# EasyEDA Pro project ProPrj_PowMr-Hybrid-Inverter_2024-11-03.epro

# Schematic PowMr Hybrid Inverter

## Sheets
1 Main board
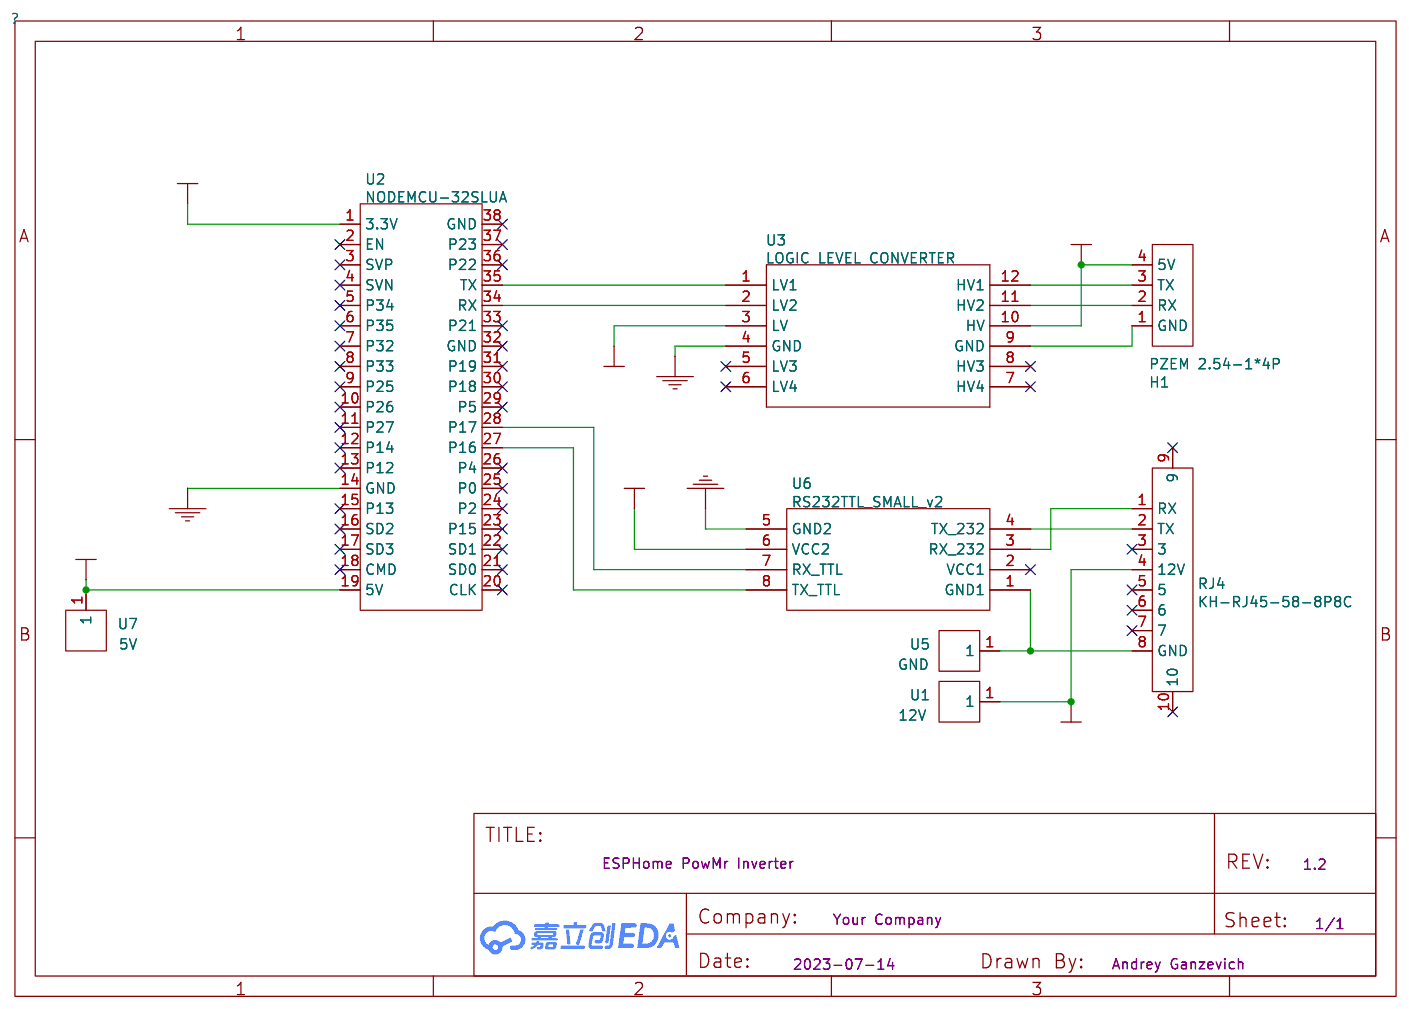
[diagram p0: Main board]
2 Modules: Board Name: PowMr Hybrid Inverter; Create Date: 2024-09-08; Page Name: Modules; Schematic Name: PowMr Hybrid Inverter; Update Date: 2024-09-10
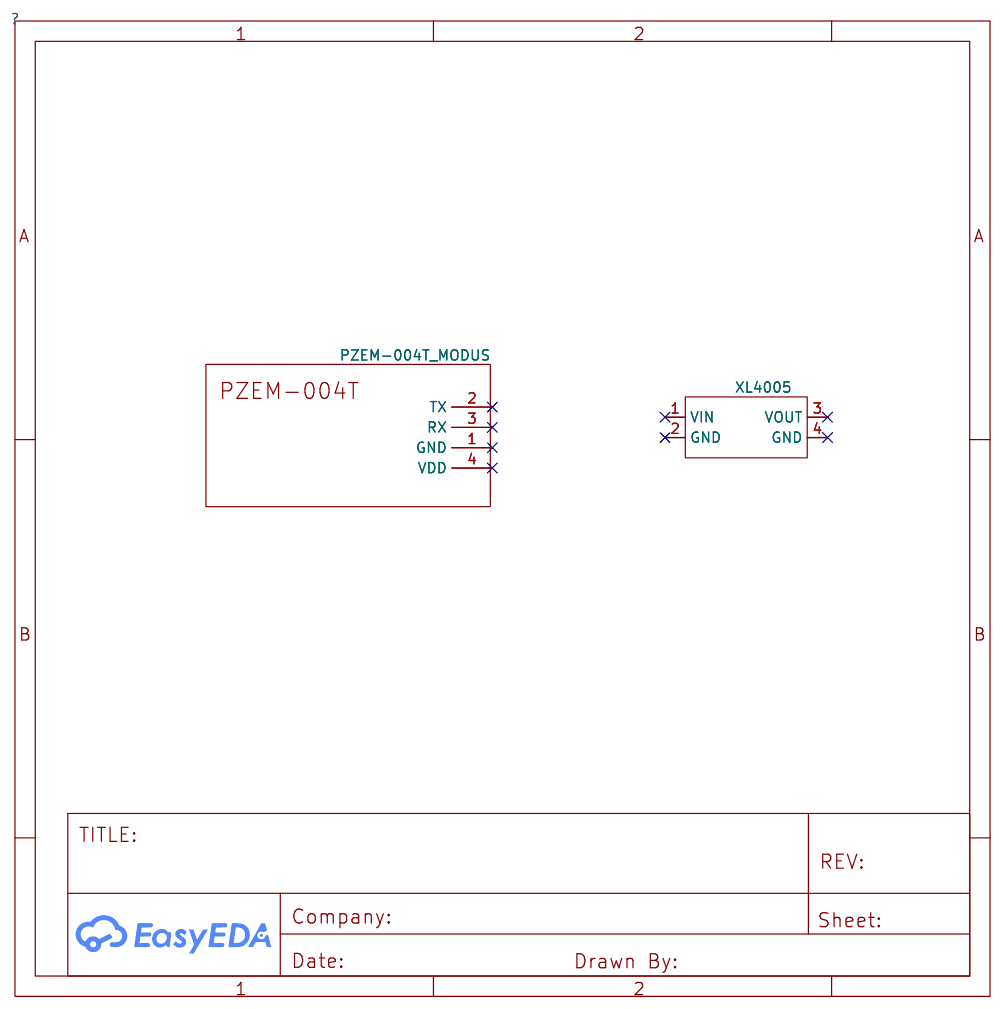
[diagram p1: Modules]

## Parts
sheet Main board
H1  PZEM 2.54-1*4P  [HDR-TH_4P-P2.54-H-M-W10.4]
RJ4  KH-RJ45-58-8P8C  [RJ45-TH_KH-RJ45-58-8P8C]
U1  12V  [2X2MMPAD]  (no BOM)
U2  NODEMCU-32SLUA  [COMM-TH_NODEMCU-32SLUA]
U3  LOGIC LEVEL CONVERTER  [LOGIC LEVEL CONVERTER]
U5  GND  [2X2MMPAD]  (no BOM)
U6  RS232TTL_SMALL_v2  [RS232TTL_SMALL]
U7  5V  [2X2MMPAD]  (no BOM)
sheet Modules
U4  PZEM-004T_MODUS  [PZEM-004T-V3]
U8  XL4005  [XL4005_SAAD]

## Library data of the parts
H1 = PZEM 2.54-1*4P: Supplier: LCSC; Supplier Part: C91552; Manufacturer: BOOMELE(博穆精密); Manufacturer Part: 2.54-1*4P反弯排针; JLCPCB Part Class: Extended Part
RJ4 = KH-RJ45-58-8P8C: Supplier: LCSC; Supplier Part: C2683360; Manufacturer: kinghelm(金航标); JLCPCB Part Class: Extended Part; link: https://lcsc.com/eda_search?q=C2683360&amp;%26type=1&amp;ref=editor
U1 = 12V
U2 = NODEMCU-32SLUA: Supplier: LCSC; Supplier Part: C111436; Manufacturer: Ai-Thinker(安信可); Manufacturer Part: NodeMCU-32SLua; JLCPCB Part Class: Extended Part; link: https://atta.szlcsc.com/upload/public/pdf/source/20200715/C111436_7E615125D57381075B07FD61BFD5F595.pdf
U3 = LOGIC LEVEL CONVERTER
U5 = GND
U6 = RS232TTL_SMALL_v2: Supplier: BANGGOOD
U7 = 5V
U4 = PZEM-004T_MODUS: Manufacturer Part: New SchematicLib
U8 = XL4005

## Nets
+5V: H1.4(5V) U2.19(5V) U3.10(HV) U7.1
+12V: RJ4.4(12V) U1.1
GND: U2.14(GND) U3.4(GND) U6.5(GND2)
VCC: U2.1(3.3V) U3.3(LV) U6.6(VCC2)
$1N4: U2.35(TX) U3.1(LV1)
$1N5: U2.34(RX) U3.2(LV2)
$1N8: H1.1(GND) U3.9(GND)
$1N9: U2.28(P17) U6.7(RX TTL)
$1N10: U2.27(P16) U6.8(TX TTL)
$1N11: RJ4.1(RX) U6.3(RX 232)
$1N12: RJ4.2(TX) U6.4(TX 232)
$1N13: RJ4.8(GND) U5.1 U6.1(GND1)
$1N18: H1.3(TX) U3.12(HV1)
$1N19: H1.2(RX) U3.11(HV2)

Not connected (* = marked no-connect by the designer): RJ4 3* 5* 6* 7* 9* 10*; U2 2(EN)* 3(SVP)* 4(SVN)* 5(P34)* 6(P35)* 7(P32)* 8(P33)* 9(P25)* 10(P26)* 11(P27)* 12(P14)* 13(P12)* 15(P13)* 16(SD2)* 17(SD3)* 18(CMD)* 20(CLK)* 21(SD0)* 22(SD1)* 23(P15)* 24(P2)* 25(P0)* 26(P4)* 29(P5)* 30(P18)* 31(P19)* 32(GND)* 33(P21)* 36(P22)* 37(P23)* 38(GND)*; U3 5(LV3)* 6(LV4)* 7(HV4)* 8(HV3)*; U4 1(GND)* 2(TX)* 3(RX)* 4(VDD)*; U6 2(VCC1)*; U8 1(VIN)* 2(GND)* 3(VOUT)* 4(GND)*

# Board 1-PCB_PCB_PowMr Inverter
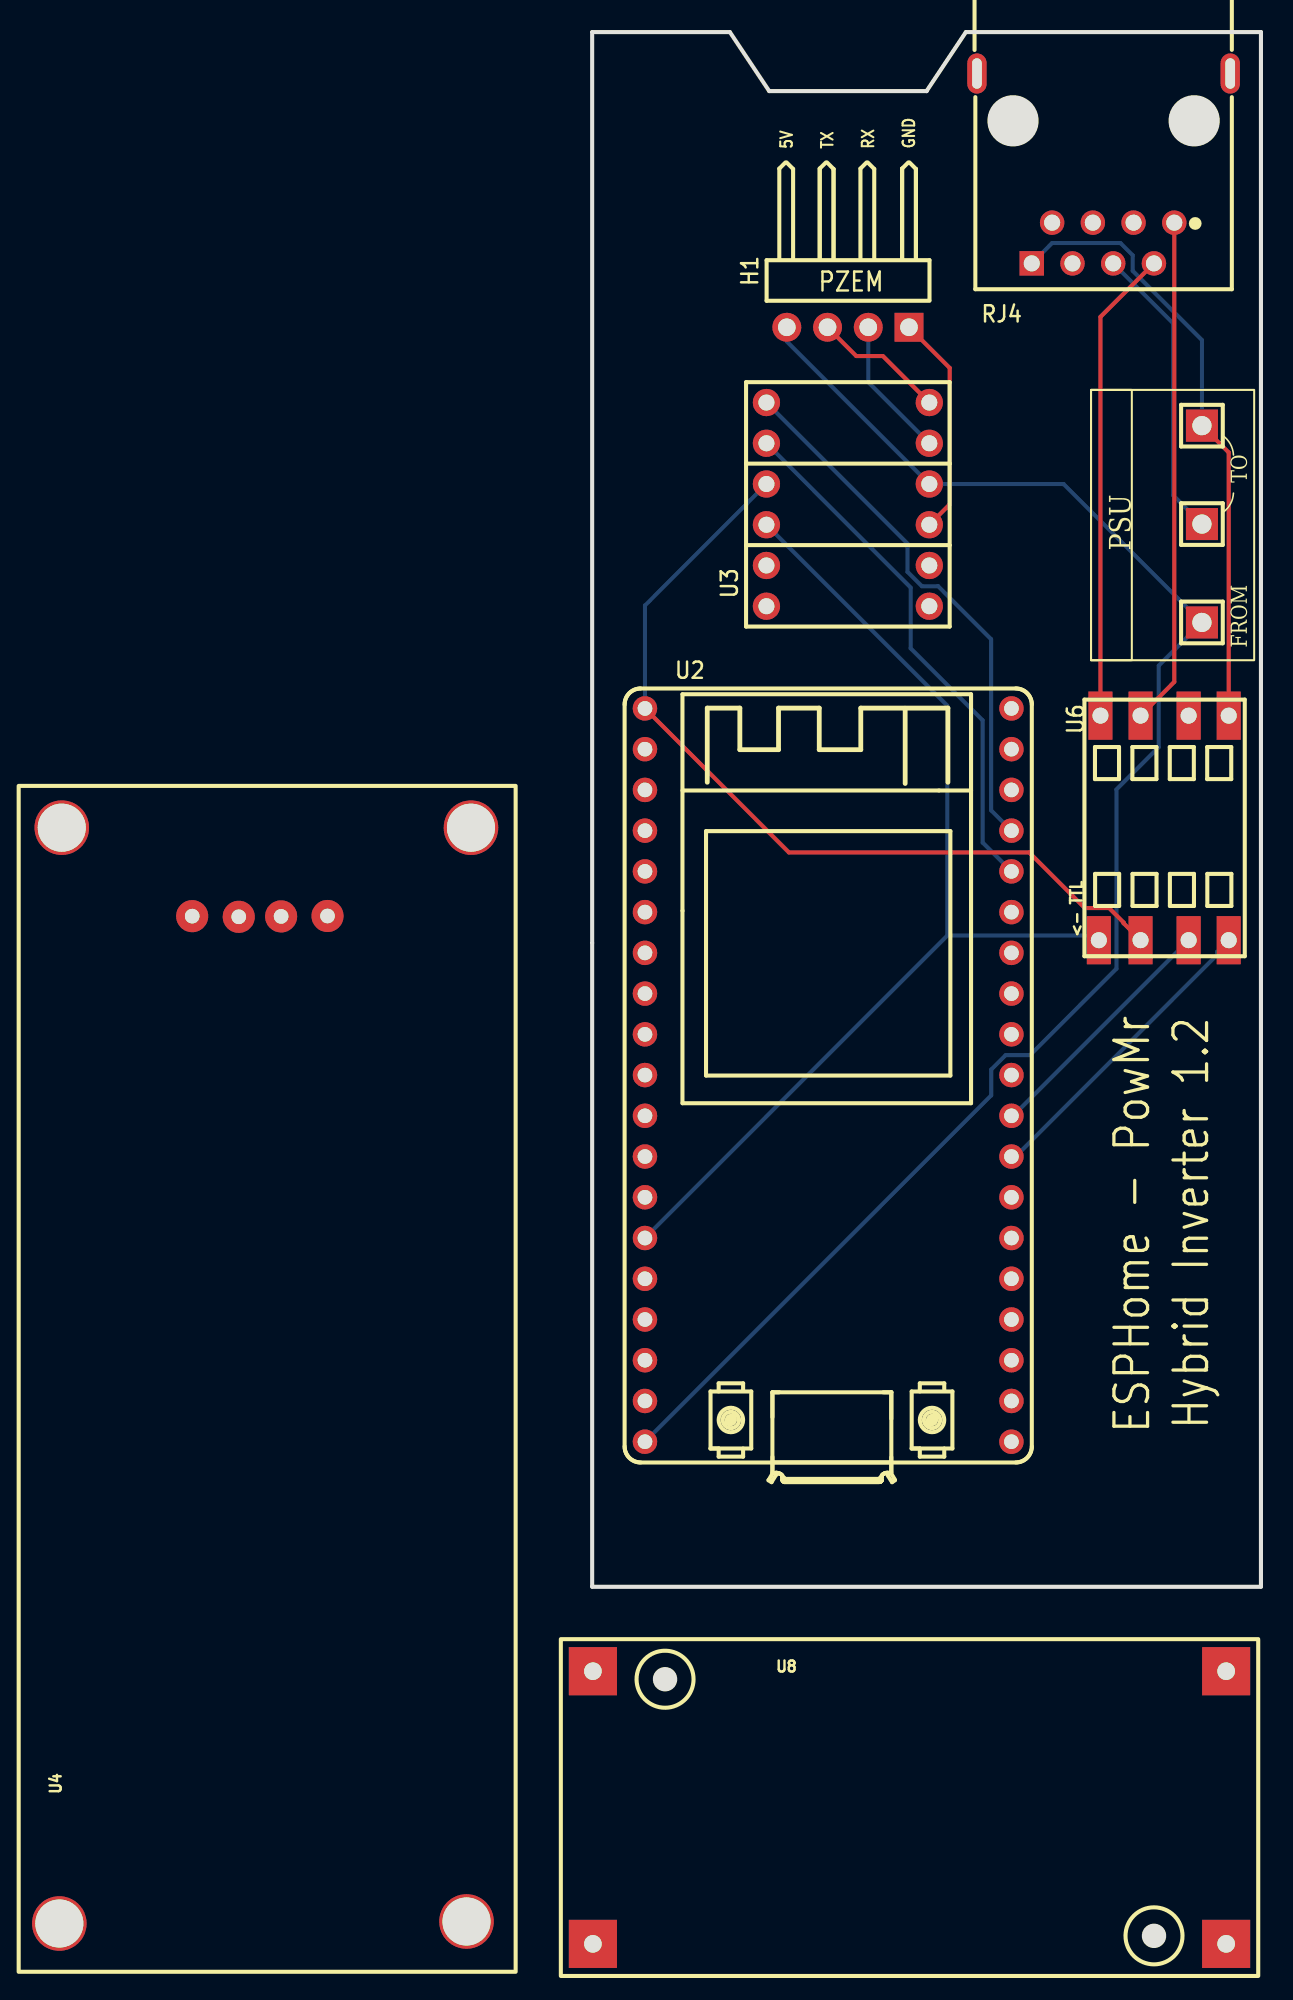
[diagram p2: board, top side]
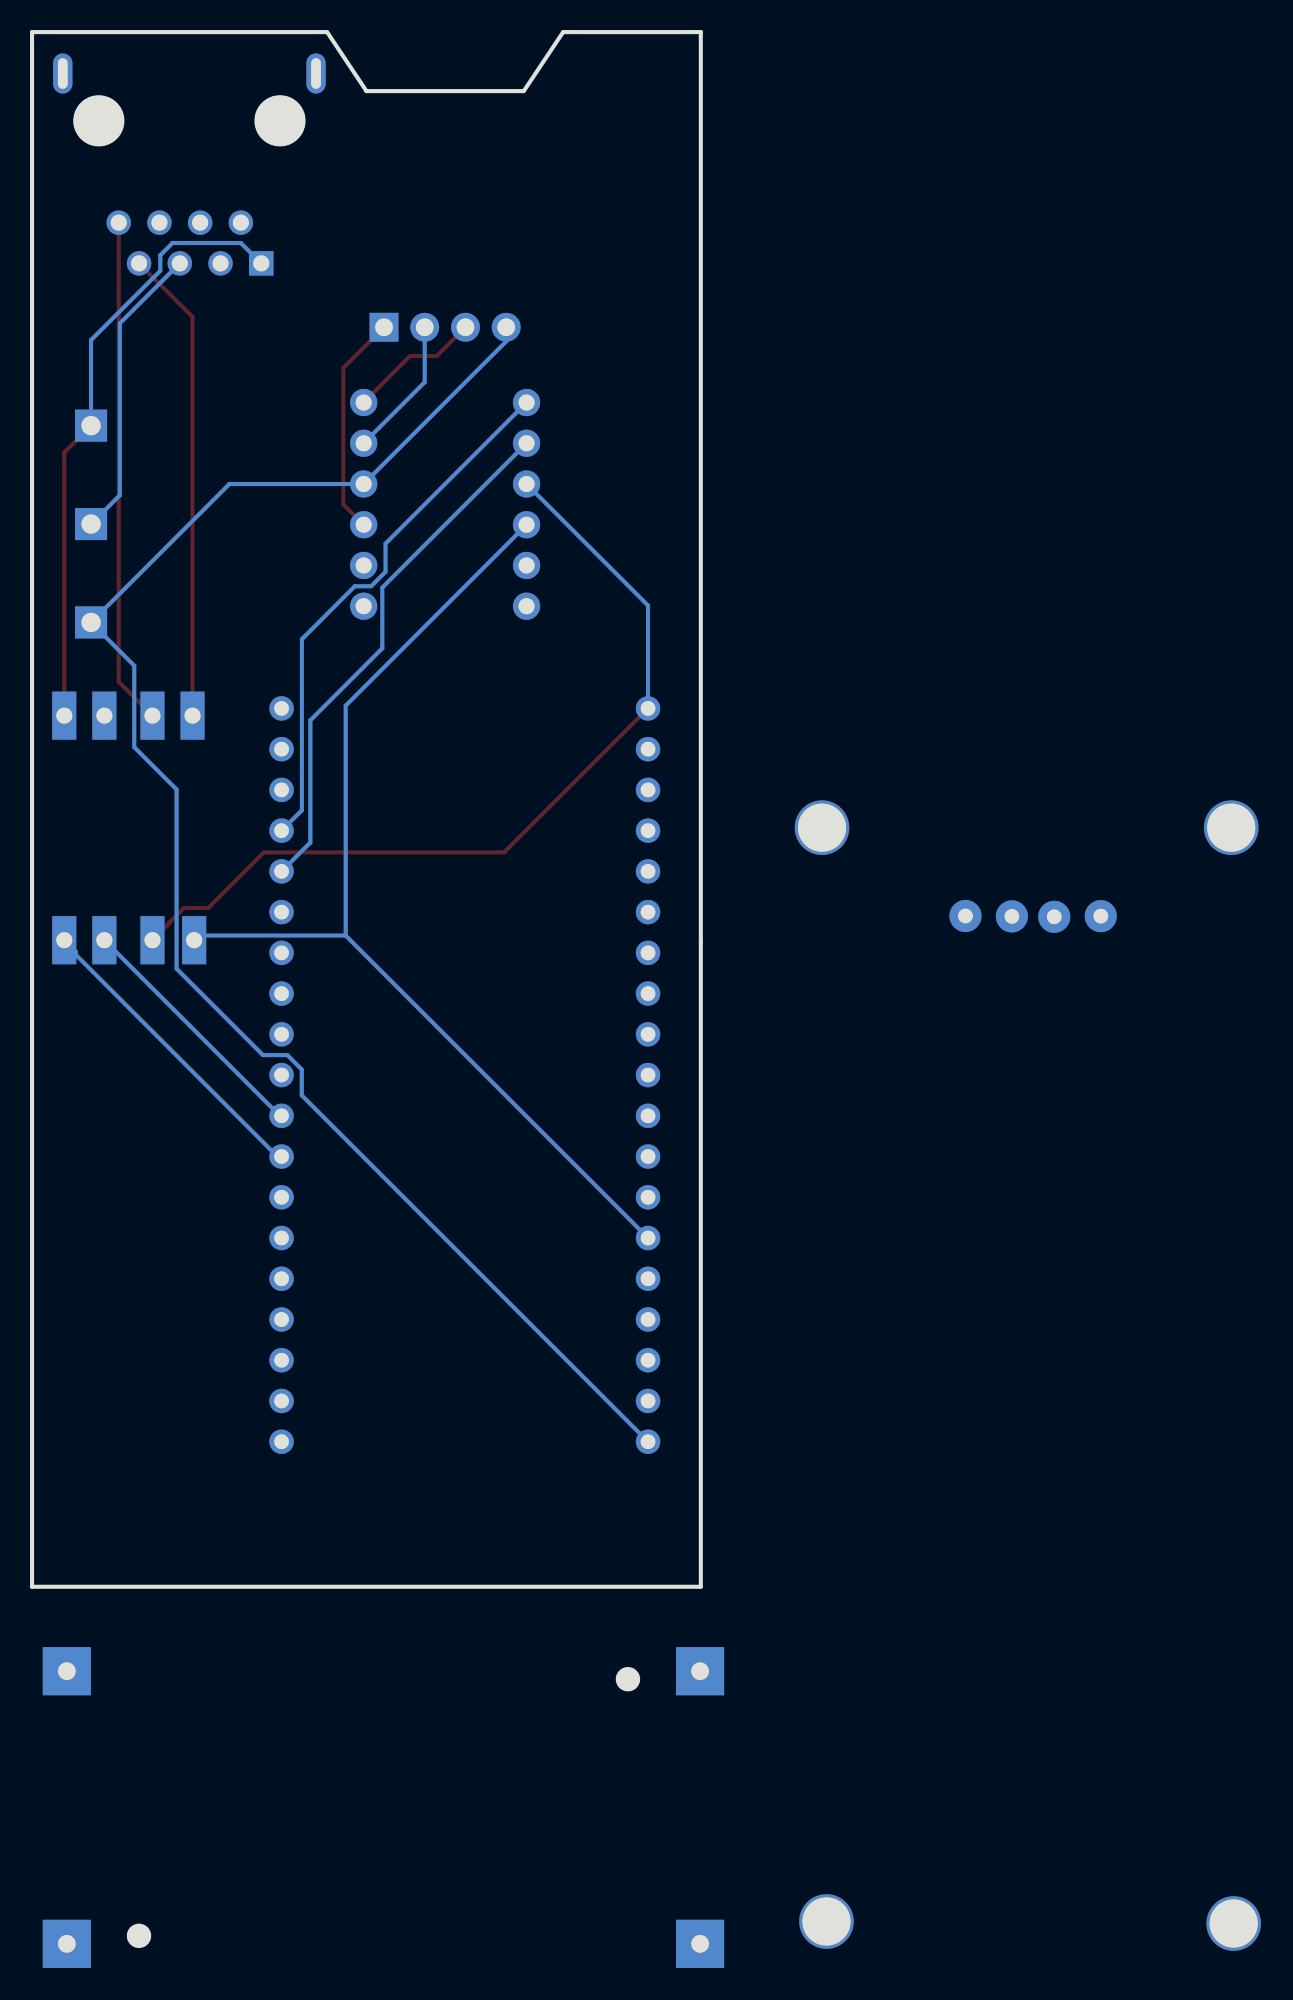
[diagram p3: board, bottom side, seen from below]

Outline 41.72 x 119.46 mm; copper layers: Top Layer, Bottom Layer. Coordinates in mm from the lower left corner of the outline.
Outline path: 0,119.46 8.59,119.46 11.04,115.78 20.86,115.78 23.31,119.46 41.72,119.46 41.72,22.53 0,22.53 0,119.46
Stack: Top Layer 0.035mm / Dielectric1 1.51mm FR4 er 4.5 / Bottom Layer 0.035mm

## Design rules (mm)
spacing Default (default): track to track 0.152, other pairs 0 to 0.152
track width Default (default): min 0.254, default 0.254, max 25.4
differential pair differentialPair (default): width min 0.127, default 0.254, max 2.54; gap min 0.152, default 0.152
via Default (default): diameter min 0.61, default 0.61, max 100.025; hole min 0.305, default 0.305, max 59.995

## Placement (name value [footprint] x y rotation side)
H1  PZEM 2.54-1*4P  [HDR-TH_4P-P2.54-H-M-W10.4]  15.95 101.05 180 top
RJ4  KH-RJ45-58-8P8C  [RJ45-TH_KH-RJ45-58-8P8C]  31.9 110.96 180 top
U1  12V  [2X2MMPAD]  38.04 88.78 90 top
U2  NODEMCU-32SLUA  [COMM-TH_NODEMCU-32SLUA]  14.72 54.43 0 top
U3  -  [LOGIC LEVEL CONVERTER]  15.95 90.01 0 top
U4  PZEM-004T_MODUS  [PZEM-004T-V3]  -35.77 -1.48 90 top
U5  GND  [2X2MMPAD]  38.04 94.92 90 top
U6  RS232TTL_SMALL_v2  [RS232TTL_SMALL]  31.71 76.84 270 top
U7  5V  [2X2MMPAD]  38.04 82.65 90 top
U8  XL4005  [XL4005_SAAD]  21.55 8.26 180 top

## Footprints (pads in the part's own frame, mm; a bottom-side part is the same pattern mirrored in y, then rotated)
2X2MMPAD
  rect 2x2 hole 1.199: 1(0,0)
COMM-TH_NODEMCU-32SLUA
  round 1.524 hole 0.914: 1(-11.43,22.86) 2(-11.43,20.32) 3(-11.43,17.78) 4(-11.43,15.24) 5(-11.43,12.7) 6(-11.43,10.16) 7(-11.43,7.62) 8(-11.43,5.08) 9(-11.43,2.54) 10(-11.43,0) 11(-11.43,-2.54) 12(-11.43,-5.08) 13(-11.43,-7.62) 14(-11.43,-10.16) 15(-11.43,-12.7) 16(-11.43,-15.24) 17(-11.43,-17.78) 18(-11.43,-20.32) 19(-11.43,-22.86) 20(11.43,-22.86) 21(11.43,-20.32) 22(11.43,-17.78) 23(11.43,-15.24) 24(11.43,-12.7) 25(11.43,-10.16) 26(11.43,-7.62) 27(11.43,-5.08) 28(11.43,-2.54) 29(11.43,0) 30(11.43,2.54) 31(11.43,5.08) 32(11.43,7.62) 33(11.43,10.16) 34(11.43,12.7) 35(11.43,15.24) 36(11.43,17.78) 37(11.43,20.32) 38(11.43,22.86)
HDR-TH_4P-P2.54-H-M-W10.4
  rect 1.8x1.8 hole 1.1: 1(-3.81,0)
  round 1.8 hole 1.1: 2(-1.27,0) 3(1.27,0) 4(3.81,0)
LOGIC LEVEL CONVERTER
  round 1.7 hole 1: 1(-5.08,6.35) 2(-5.08,3.81) 3(-5.08,1.27) 4(-5.08,-1.27) 5(-5.08,-3.81) 6(-5.08,-6.35) 7(5.08,-6.35) 8(5.08,-3.81) 9(5.08,-1.27) 10(5.08,1.27) 11(5.08,3.81) 12(5.08,6.35)
PZEM-004T-V3
  round 2 hole 0.914: 1(65.819,-10.823) 2(65.778,-13.729) 3(65.803,-16.37) 4(65.829,-19.266)
  round 3.4 hole 3: 9(71.335,-28.215) 10(71.335,-2.688) 11(3.136,-27.935) 12(3.01,-2.535)
RJ45-TH_KH-RJ45-58-8P8C
  round 1.524 hole 1: 1(-4.41,3.38) 2(-3.14,5.92) 3(-1.87,3.38) 4(-0.6,5.92) 5(0.67,3.38) 6(1.94,5.92) 7(3.21,3.38)
  rect 1.524x1.524 hole 1: 8(4.48,5.92)
  oval 1.2x2.5 hole 0.6x1.9: 9(-7.9,-5.92) 10(7.9,-5.92)
RS232TTL_SMALL
  rect 3x1.5 hole 1: 1(0,8) 2(0,5.5) 3(0,2.5) 4(0,0) 5(14,-0.102) 6(14,2.5) 7(14,5.5) 8(14,8)
XL4005_SAAD
  rect 3x3 hole 1.1: 1(-18,8) 2(-18,-9) 3(21.5,8) 4(21.5,-9)

## Nets
As in the schematic.

Pads without a net: RJ4 3 5 6 7 9 10; U2 2 3 4 5 6 7 8 9 10 11 12 13 15 16 17 18 20 21 22 23 24 25 26 29 30 31 32 33 36 37 38; U3 5 6 7 8; U4 1 2 3 4 9 10 11 12; U6 2; U8 1 2 3 4

## Routing (per net, layer and track width the routed paths; a pad name or vN(x,y) marks a point on that pad's centre or on a via; arc(x,y) is an arc through that point)
+5V: length 100.4
  Bottom Layer w0.254: U2.19 24.89,53.17 24.89,54.77 25.79,55.67 27.31,55.67 32.7,61.06 32.7,72.24 35.34,74.88 35.34,79.96 U7.1 29.41,91.28 U3.10 12.14,100.17 H1.4
+12V: length 18.5
  Bottom Layer w0.254: RJ4.4 36.24,101.3 36.24,90.58 U1.1
GND: length 66.5
  Bottom Layer w0.254: U2.14 22.15,63.13 ; 22.15,63.13 31.32,63.13 U6.5 ; 22.15,63.13 22.15,77.46 U3.4
VCC: length 54.1
  Top Layer w0.254: U6.6 33.15,63.9 33.15,63.94 32.25,64.84 30.73,64.84 27.26,68.31 12.27,68.31 U2.1
  Bottom Layer w0.254: U3.3 3.29,83.7 U2.1
$1N4: length 33.6
  Bottom Layer w0.254: U3.1 19.67,87.56 19.67,85.81 20.57,84.91 21.58,84.91 24.88,81.61 24.88,70.94 U2.35
$1N5: length 33
  Bottom Layer w0.254: U3.2 19.87,84.82 19.87,81.03 24.36,76.54 24.36,68.92 U2.34
$1N8: length 13.9
  Top Layer w0.254: H1.1 22.3,98.51 22.3,90.01 U3.9
$1N9: length 15.6
  Bottom Layer w0.254: U2.28 26.26,51.89 U6.7
$1N10: length 19.3
  Bottom Layer w0.254: U6.8 38.98,62.11 38.98,61.92 26.41,49.35 U2.27
$1N11: length 31.6
  Top Layer w0.254: U6.3 36.31,78.94 RJ4.1
$1N12: length 29.6
  Top Layer w0.254: U6.4 31.71,101.7 RJ4.2
$1N13: length 38.3
  Top Layer w0.254: U5.1 39.71,93.25 U6.1
  Bottom Layer w0.254: U5.1 38.04,100.25 33.72,104.57 33.72,105.54 32.96,106.31 28.69,106.31 RJ4.8
$1N18: length 8.3
  Top Layer w0.254: H1.3 16.48,99.26 18.13,99.26 U3.12
$1N19: length 8.8
  Bottom Layer w0.254: H1.2 17.22,97.63 U3.11

## Text on the board
Top Silkscreen Layer: 5V | TX | RX | GND | <- TTL | PZEM | ESPHome - PowMr | Hybrid Inverter 1.2 | TO | FROM | PSU
